# Altium schematic sheet rpm.SchDoc
size A4
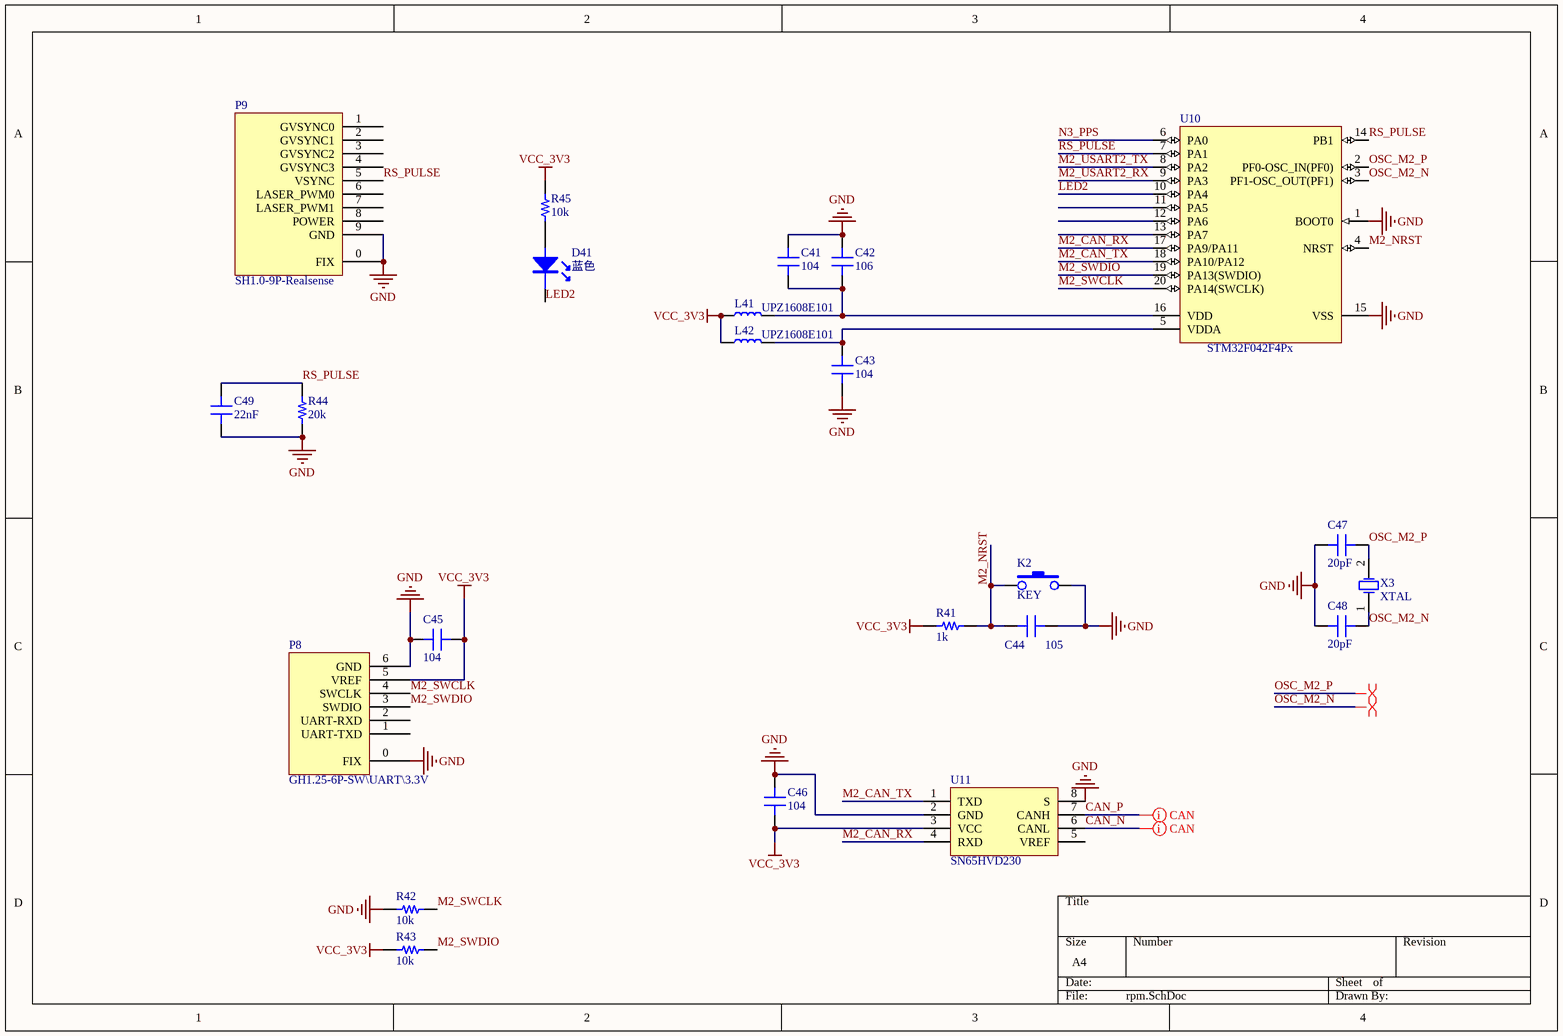
[diagram p0: rpm.SchDoc]

## Parts
C41  104  [C0603/1608]
C42  106  [C0603/1608]
C43  104  [C0603/1608]
C44  105  [C0603/1608]
C45  104  [C0603/1608]
C46  104  [C0603/1608]
C47  20pF  [C0603/1608]
C48  20pF  [C0603/1608]
C49  22nF  [C0603/1608]
D41  Color: 蓝色  [LED0603-蓝色]  (hidden comment: LED-蓝色)
K2  KEY  [按键（2脚）]
L41  UPZ1608E101  [L0603/1608]
L42  UPZ1608E101  [L0603/1608]
P8  GH1.25-6P-SW\UART\3.3V  [GH1.25-6P（立贴）]
P9  SH1.0-9P-Realsense  [FPC1.0-2H-WS-9P]
R41  1k  [R0603/1608]
R42  10k  [R0603/1608]
R43  10k  [R0603/1608]
R44  20k  [R0603/1608]
R45  10k  [R0603/1608]
U10  STM32F042F4Px  [TSSOP20]
U11  SN65HVD230  [SOP-8]
X3  XTAL  [XTAL-49S]

## Nets
GND: C41.1 C42.1 C43.1 C44.1 C45.2 C46.2 C47.2 C48.2 C49.2 K2.2 P8.0(FIX) P8.6(GND) P9.0(FIX) P9.9(GND) R42.1 R44.1 U10.1(BOOT0) U10.15(VSS) U11.2(GND) U11.8(S)
VCC_3V3: C45.1 C46.1 L41.1 L42.1 P8.5(VREF) R41.1 R43.1 R45.2 U11.3(VCC)
CAN_N: U11.6(CANL)
CAN_P: U11.7(CANH)
LED2: D41.2(K) U10.10(PA4)
M2_CAN_RX: U10.17(PA9/PA11) U11.4(RXD)
M2_CAN_TX: U10.18(PA10/PA12) U11.1(TXD)
M2_NRST: C44.2 K2.1 R41.2 U10.4(NRST)
M2_SWCLK: P8.4(SWCLK) R42.2 U10.20(PA14(SWCLK))
M2_SWDIO: P8.3(SWDIO) R43.2 U10.19(PA13(SWDIO))
M2_USART2_RX: U10.9(PA3)
M2_USART2_TX: U10.8(PA2)
N3_PPS: U10.6(PA0)
OSC_M2_N: C48.1 U10.3(PF1-OSC_OUT(PF1)) X3.1(OSC1)
OSC_M2_P: C47.1 U10.2(PF0-OSC_IN(PF0)) X3.2(OSC2)
RS_PULSE: C49.1 P9.5(VSYNC) R44.2 U10.7(PA1) U10.14(PB1)
NetC41_2: C41.2 C42.2 L41.2 U10.16(VDD)
NetC43_2: C43.2 L42.2 U10.5(VDDA)
NetD41_1: D41.1(A) R45.1

Not connected (* = marked no-connect by the designer): P8 1(UART-TXD) 2(UART-RXD); P9 1(GVSYNC0) 2(GVSYNC1) 3(GVSYNC2) 4(GVSYNC3) 6(LASER_PWM0) 7(LASER_PWM1) 8(POWER); U10 11(PA5) 12(PA6) 13(PA7); U11 5(VREF)

## Layout directives
differential pair: CAN_N, CAN_P, OSC_M2_N, OSC_M2_P

## Library data of the parts
C41-C49 = 陶瓷电容
D41 = LED: 发光二极管
K2 = 按键（2脚）: 按键-2脚贴片
L41 L42 = 磁珠: 贴片磁珠
R41-R45 = 电阻
U11 = SN65HVD230: CAN收发芯片
X3 = 晶振: Published: 8-Jun-2000; LatestRevisionDate: 17-Jul-2002; LatestRevisionNote: Re-released for DXP Platform.; Publisher: Altium Limited